# Altium project Powerdist Darput.PrjPCB
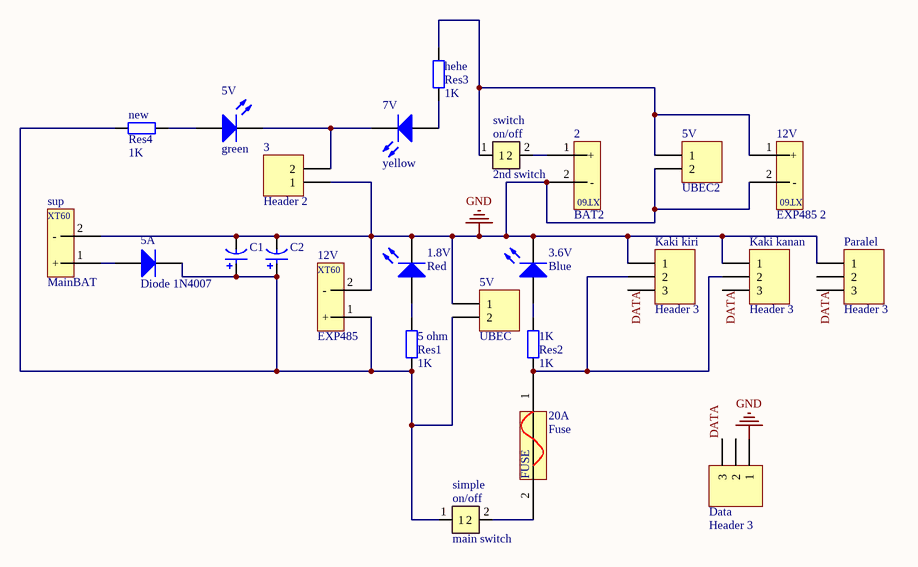
[diagram p0: Powerdist Darput.SchDoc]
1 sheet, 25 parts. Net scope: global (net labels, ports and power ports of the same name join across sheets).
Board file: Powerdist Darput.PcbDoc

## Sheet Powerdist Darput.SchDoc
size A

### Parts
(Parts that share a designator on the sheet are numbered #1, #2 ... from top to bottom, then left to right.)
1.8V  Red  [LED5mm R]
1K  Res2  value 1K  [AXIAL-0.4]
2  BAT2  [PCBComponent_1]
3  Header 2  [HDR1X2]
3.6V  Blue  [LED5mm R]
5_ohm  Res1  value 1K  [AXIAL-0.4]
5A  Diode 1N4007  [DO-41]
5V#1  green  [LED5mm R]
5V#2  UBEC2  [HDR1X2]
5V#3  UBEC  [HDR1X2]
7V  yellow  [LED5mm R]
12V#1  EXP485 2  [PCBComponent_1]
12V#2  EXP485  [PCBComponent_1]
20A  Fuse  [PCBComponent_1]
C1  Cap Pol  [CAPASITOR RAD 5.6 mm "1/.2"]  (value not drawn)
C2  Cap Pol  [CAPASITOR RAD 5.6 mm "1/.2"]  (value not drawn)
Data  Header 3  [HDR1X3]
hehe  Res3  value 1K  [AXIAL-0.4]
Kaki_kanan  Header 3  [HDR1X3]
Kaki_kiri  Header 3  [HDR1X3]
new  Res4  value 1K  [AXIAL-0.4]
Paralel  Header 3  [HDR1X3]
simple  main switch  [PCBComponent_1]
sup  MainBAT  [PCBComponent_1]
switch  2nd switch  [PCBComponent_1]

### Nets
GND: 1.8V.2(K) 2.2(-) 3.1 3.6V.2(K) 5V#2.2 5V#3.1 12V#1.2(-) 12V#2.2(-) C1.2 C2.2 Data.1 Kaki_kanan.1 Kaki_kiri.1 Paralel.1 sup.2(-)
DATA: Data.3 Kaki_kanan.3 Kaki_kiri.3 Paralel.3
Net1.8V_1: 1.8V.1(A) 5_ohm.1
Net1K_1: 1K.1 20A.1 Kaki_kanan.2 Kaki_kiri.2
Net1K_2: 1K.2 3.6V.1(A)
Net2_1: 2.1(+) switch.2
Net3_2: 3.2 5V#1.2(K) 7V.2(K)
Net5_ohm_2: 5_ohm.2 5A.2(K) 5V#3.2 12V#2.1(+) C1.1 C2.1 new.1 simple.1
Net5A_1: 5A.1(A) sup.1(+)
Net5V#1_1: 5V#1.1(A) new.2
Net5V#2_1: 5V#2.1 12V#1.1(+) hehe.1 switch.1
Net7V_1: 7V.1(A) hehe.2
Net20A_2: 20A.2 simple.2

Not connected (* = marked no-connect by the designer): Data 2; Paralel 2

### Notes on the sheet
- (in symbol Component_1) FUSE; on/off
- (in symbol Component_2) XT60

### Library data of the parts
1.8V 3.6V 5V#1 7V = LED1: Typical RED GaAs LED; Published: 8-Jun-2000; LatestRevisionDate: 08-Jul-2005; LatestRevisionNote: Mech Layer 1 removed.; Publisher: Altium Limited; PackageDescription: LED; 2 Leads
1K 5_ohm hehe new = Res2: Resistor; Published: 8-Jun-2000; LatestRevisionDate: 17-Jul-2002; LatestRevisionNote: Re-released for DXP Platform.; PackageReference: AXIAL-0.4; Publisher: Altium Limited; PackageDescription: Axial Device, Thru-Hole; 2 Leads; 0.4 in Pin Spacing
2 12V#1 12V#2 sup = Component_2
3 5V#2 5V#3 = Header 2: Header, 2-Pin; LatestRevisionDate: 17-Jul-2002; LatestRevisionNote: Re-released for DXP Platform.; Publisher: Altium Limited
5A = Diode 1N4007: 1 Amp General Purpose Rectifier; Published: 8-Jun-2000; LatestRevisionDate: 17-Jul-2002; LatestRevisionNote: Re-released for DXP Platform.; DatasheetVersion: 1998; PackageVersion: Aug-1999; PackageReference: DO-41; Publisher: Altium Limited; PackageDescription: Diode, Axial; Body 5.2 x 2.7 mm (LxDia. max), Lead Dia. 0.86 mm (max); Code_JEDEC: DO-204-AL; ComponentLink1Description: Manufacturer Link; ComponentLink1URL: http://www.fairchildsemi.com/; ComponentLink2Description: Datasheet; ComponentLink2URL: http://www.fairchildsemi.com/ds/1N%2F1N4001.pdf
20A simple switch = Component_1
C1 C2 = Cap Pol: Polarized Capacitor (Radial); Published: 8-Jun-2000; LatestRevisionDate: 17-Jul-2002; LatestRevisionNote: Re-released for DXP Platform.; PackageReference: RB7.6-15; Publisher: Altium Limited; PackageDescription: Polarized Capacitor (Radial); 2 Leads
Data Kaki_kanan Kaki_kiri Paralel = Header 3: Header, 3-Pin; LatestRevisionDate: 17-Jul-2002; LatestRevisionNote: Re-released for DXP Platform.; Publisher: Altium Limited